# Altium schematic sheet Schematic.SchDoc: Smart Home
size A; Author: TND3-6; PageSetup: Record=PageOptions|CenterHorizontal=True|CenterVertical=True|PrintScale=0.50|XCorrection=1.00|YCorrection=1.00|PrintKind=2|BorderSize=5000000|LeftOffset=0|BottomOffset=0|Orientation=2|PaperLength=1000|PaperWidth=1000|Scale=100|PaperSource=7|PrintQuality=-3|MediaType=1|DitherType=10|PrintScaleMode=0|PaperKind=Letter|PaperIndex=1; Rule: PcbType=ProtelPcb
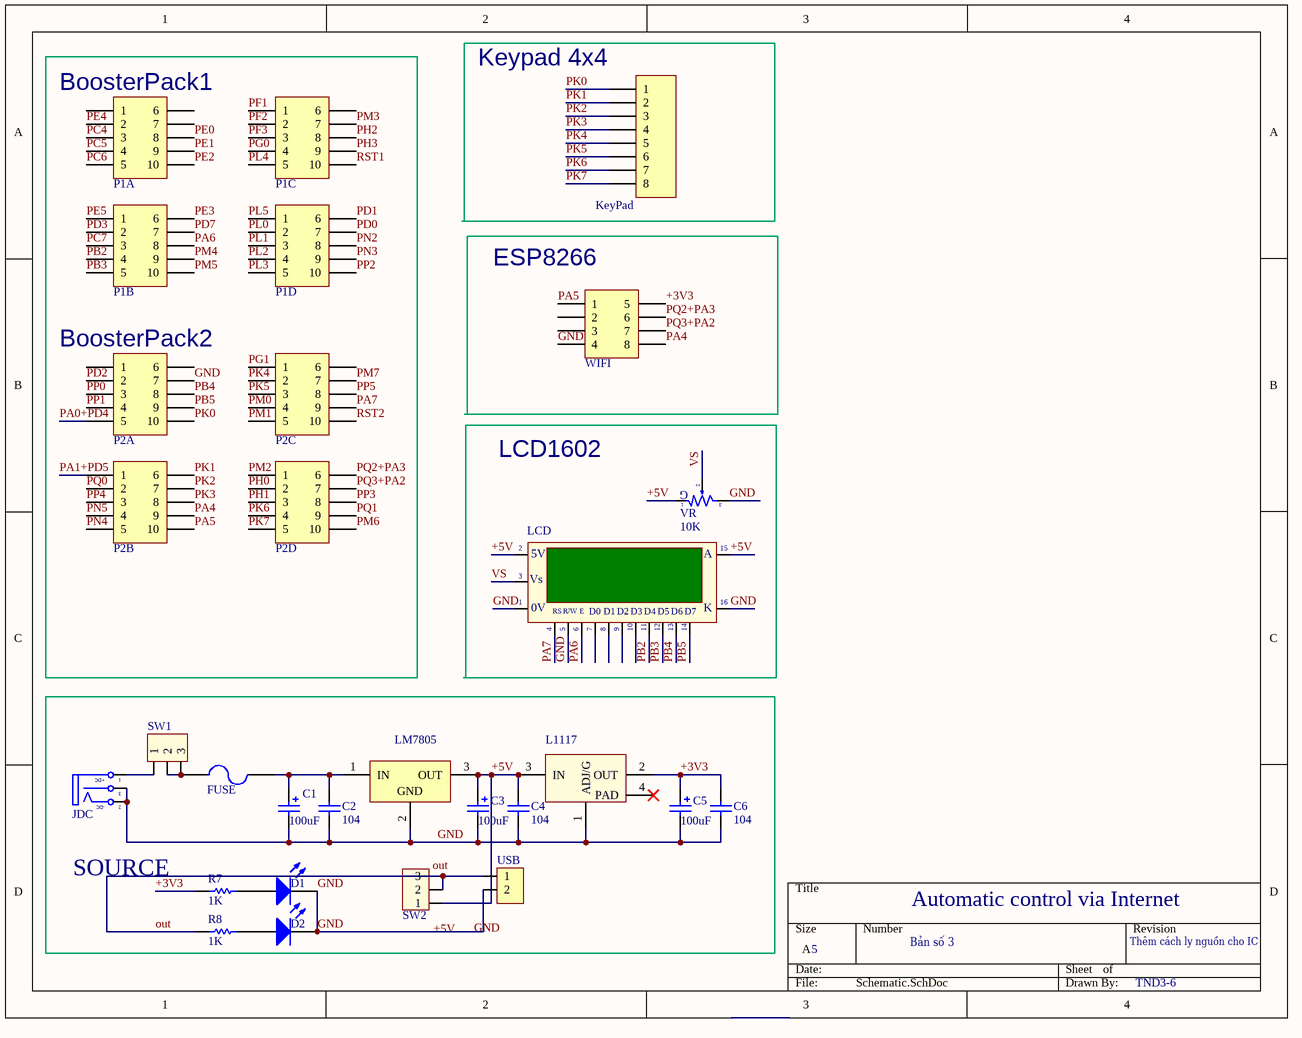
[diagram p0: Schematic.SchDoc]

## Parts
C1  value 100uF  [CP1/2]  (hidden comment: Cap Pol)
C2  value 104  [CN1]  (hidden comment: Cap Non-Pol)
C3  value 100uF  [CP1/2]  (hidden comment: Cap Pol)
C4  value 104  [CN1]  (hidden comment: Cap Non-Pol)
C5  value 100uF  [CP1/2]  (hidden comment: Cap Pol)
C6  value 104  [CN1]  (hidden comment: Cap Non-Pol)
D1  LED  [LED-3mm]  (value not drawn)
D2  LED  [LED-3mm]  (value not drawn)
FUSE  Fuse  [FUSE]  (value not drawn)
JDC  Jack DC  [DC-IN]  (value not drawn)
KeyPad  Header 8  [JP8]  (value not drawn)
L1117  LM1117  [SOT223-4N]  (value not drawn)
LCD  (no value)  [LCD16X2]
LM7805  LM7805  [QTO-220]  (value not drawn)
P1A  Header 5X2  [JP5X2]  (value not drawn)
P1B  Header 5X2  [JP5X2]  (value not drawn)
P1C  Header 5X2  [JP5X2]  (value not drawn)
P1D  Header 5X2  [JP5X2]  (value not drawn)
P2A  Header 5X2  [JP5X2]  (value not drawn)
P2B  Header 5X2  [JP5X2]  (value not drawn)
P2C  Header 5X2  [JP5X2]  (value not drawn)
P2D  Header 5X2  [JP5X2]  (value not drawn)
R7  value 1K  [RES 1/2W]  (hidden comment: RESISTOR)
R8  value 1K  [RES 1/2W]  (hidden comment: RESISTOR)
SW1  (no value)  [HED3]
SW2  (no value)  [HED3]
USB  (no value)  [Header2]
VR  10K  [VR]
WIFI  Header 4X2  [JP4x2]  (value not drawn)

## Blocks framed on the sheet
Keypad 4x4: KeyPad
ESP8266: WIFI
LCD1602: LCD VR
SOURCE: C1-C6 D1 D2 FUSE JDC L1117 LM7805 R7 R8 SW1 SW2 USB

## Nets
+3V3: C5.1 C6.2 L1117.2(OUT) R7.1 WIFI.5
+5V: C3.1 C4.2 L1117.3(IN) LCD.2(VDD) LCD.15(A) LM7805.3(OUT) SW2.1 VR.1
GND: C1.2 C2.1 C3.2 C4.1 C5.2 C6.1 D1.2(K) D2.2(K) JDC.2(TN) JDC.3(S) L1117.1(ADJ/G) LCD.1(GND) LCD.5(R/~{W}) LCD.16(K) LM7805.2(GND) P2A.7 USB.2 VR.3 WIFI.4
out: R8.1 SW2.2 SW2.3 USB.1
PA0+PD4: P2A.5
PA1+PD5: P2B.1
PA4: P2B.9 WIFI.8
PA5: P2B.10 WIFI.1
PA6: LCD.6(~{EN}) P1B.8
PA7: LCD.4(RS) P2C.9
PB2: LCD.11(D4) P1B.4
PB3: LCD.12(D5) P1B.5
PB4: LCD.13(D6) P2A.8
PB5: LCD.14(D7) P2A.9
PC4: P1A.3
PC5: P1A.4
PC6: P1A.5
PC7: P1B.3
PD0: P1D.7
PD1: P1D.6
PD2: P2A.2
PD3: P1B.2
PD7: P1B.7
PE0: P1A.8
PE1: P1A.9
PE2: P1A.10
PE3: P1B.6
PE4: P1A.2
PE5: P1B.1
PF1: P1C.1
PF2: P1C.2
PF3: P1C.3
PG0: P1C.4
PG1: P2C.1
PH0: P2D.2
PH1: P2D.3
PH2: P1C.8
PH3: P1C.9
PK0: KeyPad.1 P2A.10
PK1: KeyPad.2 P2B.6
PK2: KeyPad.3 P2B.7
PK3: KeyPad.4 P2B.8
PK4: KeyPad.5 P2C.2
PK5: KeyPad.6 P2C.3
PK6: KeyPad.7 P2D.4
PK7: KeyPad.8 P2D.5
PL0: P1D.2
PL1: P1D.3
PL2: P1D.4
PL3: P1D.5
PL4: P1C.5
PL5: P1D.1
PM0: P2C.4
PM1: P2C.5
PM2: P2D.1
PM3: P1C.7
PM4: P1B.9
PM5: P1B.10
PM6: P2D.10
PM7: P2C.7
PN2: P1D.8
PN3: P1D.9
PN4: P2B.5
PN5: P2B.4
PP0: P2A.3
PP1: P2A.4
PP2: P1D.10
PP3: P2D.8
PP4: P2B.3
PP5: P2C.8
PQ0: P2B.2
PQ1: P2D.9
PQ2+PA3: P2D.6 WIFI.6
PQ3+PA2: P2D.7 WIFI.7
RST1: P1C.10
RST2: P2C.10
VS: LCD.3(VEE) VR.2
NetC1_1: C1.1 C2.2 FUSE.2 LM7805.1(IN)
NetD1_1: D1.1(A) R7.2
NetD2_1: D2.1(A) R8.2
NetFUSE_1: FUSE.1 SW1.2 SW1.3
NetJDC_1: JDC.1(T) SW1.1

Not connected (* = marked no-connect by the designer): L1117 4(PAD)*; LCD 7(D0) 8(D1) 9(D2) 10(D3); P1A 1 6 7; P1C 6; P2A 1 6; P2C 6; WIFI 2 3

## Notes on the sheet
- (near P1A) BoosterPack1
- (near P2A) BoosterPack2
- Automatic control via Internet
- 5
- Bản số 3
- Thêm cách ly nguồn cho IC
- Labels drawn without touching a wire or pin: +5V, GND, out
- (in symbol Jack DC) +DC; -DC
- (in symbol LCD16x2A) 5V; Vs; 0V; |; R/W; E
- (in symbol VR-S) G

## Library data of the parts
C1 C3 C5 = Cap Pol: Polarized Capacitor (Radial)
C2 C4 C6 = Cap Non-Pol: Capacitor
JDC = Jack DC: Jack DC input; Value: Jac DC
KeyPad = Header 8: Header, 8-Pin; LatestRevisionDate: 17-Jul-2002; LatestRevisionNote: Re-released for DXP Platform.; Publisher: Altium Limited
L1117 = LM1117: Available in 1.8V, 2.5V, 2.85V, 3.3V, 5V, and  Adjustable Versions; Value: LM317
LCD = LCD16x2A: LCD dipslay 16 char, 2 line; Value: LCD16x2A
LM7805 = LM7805: Positive Voltage Regulator
P1A P1B P1C P1D P2A P2B P2C P2D = Header 5X2: Header, 5-Pin, Dual row; LatestRevisionDate: 17-Jul-2002; LatestRevisionNote: Re-released for DXP Platform.; Publisher: Altium Limited
SW1 SW2 = Hed3: Header 3 (Green); Value: Header 3
USB = Header2: Header IDC, 2 x 1 Pin Vertical 2.54mm Pitch (Non-Boxed, Male); Manufacturer: W¨¹rth Elektronik eiSos GmbH; partNo: 613002143121; ComponentLink1 Description: Manufacturer; ComponentLink2 Description: Datasheet; NoPins: 02; Created Date: 29 March 2013; ComponentLink1URL: http://www.we-online.com; ComponentLink2URL: http://katalog.we-online.de/em/datasheet/6130xx143121.pdf; Created by: Karrer Zheng
VR = VR-S: Var Resistor; Value: Volume 50k
WIFI = Header 4X2: Header, 4-Pin, Dual row; LatestRevisionDate: 17-Jul-2002; LatestRevisionNote: Re-released for DXP Platform.; Publisher: Altium Limited